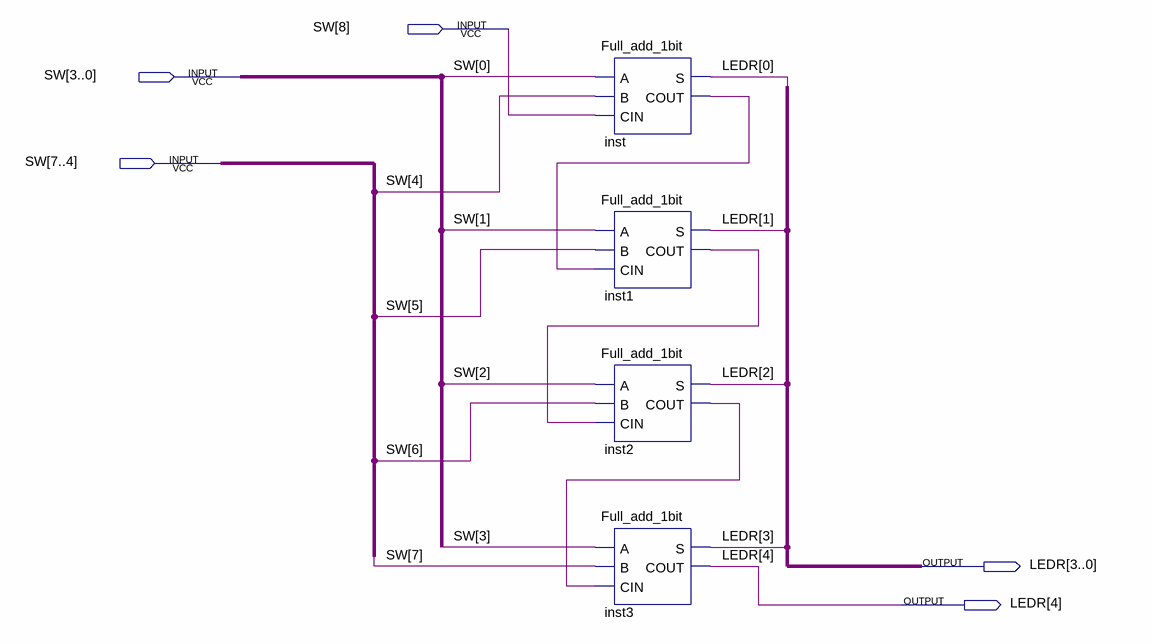
[diagram p0: schematic sheet]
// Quartus schematic Full_add_4bit.bdf as structural Verilog: 4 symbols, 5 pins
module Full_add_4bit (
  input  [8:0] SW,
  output [4:0] LEDR
);

  wire inst1_cout, inst2_cout, inst_cout;

  Full_add_1bit inst (.A(SW[0]), .B(SW[4]), .CIN(SW[8]), .S(LEDR[0]), .COUT(inst_cout));
  Full_add_1bit inst1 (.A(SW[1]), .B(SW[5]), .CIN(inst_cout), .S(LEDR[1]), .COUT(inst1_cout));
  Full_add_1bit inst2 (.A(SW[2]), .B(SW[6]), .CIN(inst1_cout), .S(LEDR[2]), .COUT(inst2_cout));
  Full_add_1bit inst3 (.A(SW[3]), .B(SW[7]), .CIN(inst2_cout), .S(LEDR[3]), .COUT(LEDR[4]));
endmodule
